# Altium schematic sheet Galileo_sEMG.SchDoc
size A4
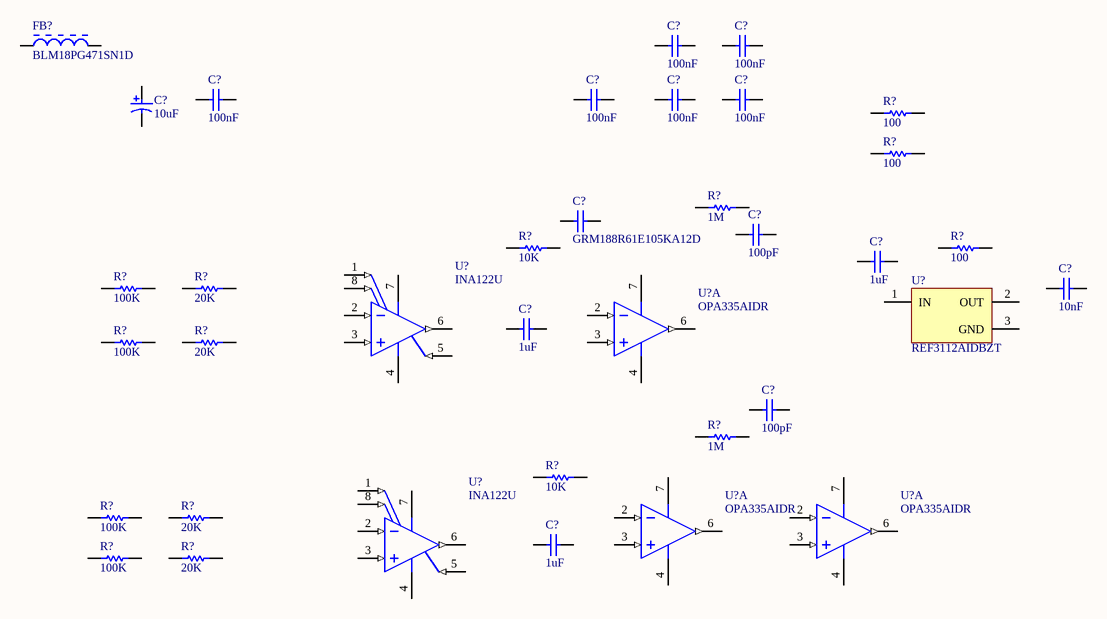
[diagram p0: Galileo_sEMG.SchDoc]

## Parts
(Parts that share a designator on the sheet are numbered #1, #2 ... from top to bottom, then left to right.)
C?#1  100nF  [CAPC0603(1608)100_M]
C?#2  100nF  [CAPC0603(1608)100_M]
C?#3  10uF  [KEMT-A-3216-18-2_M]
C?#4  100nF  [CAPC0603(1608)100_M]
C?#5  100nF  [CAPC0603(1608)100_M]
C?#6  100nF  [CAPC0603(1608)100_M]
C?#7  100nF  [CAPC0603(1608)100_M]
C?#8  GRM188R61E105KA12D  [CAPC1608X90X35LL10T15]
C?#9  100pF  [CAPC1608X90X35LL15T15]
C?#10  1uF  [CAPC1608X90X35LL10T15]
C?#11  10nF  [CAPC2013X70X45ML10T25]
C?#12  1uF  [CAPC1608X90X35LL10T15]
C?#13  100pF  [CAPC1608X90X35LL15T15]
C?#14  1uF  [CAPC1608X90X35LL10T15]
FB?  BLM18PG471SN1D  [MURA-BLM18PG_KG-CHIP-2_V1]
R?#1  100  [RESC1608X55X30NL15T15]
R?#2  100  [RESC1608X55X30NL15T15]
R?#3  1M  [RESC0603(1608)_N]
R?#4  10K  [RESC0603(1608)_N]
R?#5  100  [RESC1608X55X30NL15T15]
R?#6  100K  [RESC0603(1608)_N]
R?#7  20K  [RESC0603(1608)_L]
R?#8  100K  [RESC0603(1608)_N]
R?#9  20K  [RESC0603(1608)_L]
R?#10  1M  [RESC0603(1608)_N]
R?#11  10K  [RESC0603(1608)_N]
R?#12  100K  [RESC0603(1608)_N]
R?#13  20K  [RESC0603(1608)_L]
R?#14  100K  [RESC0603(1608)_N]
R?#15  20K  [RESC0603(1608)_L]
U?#1  REF3112AIDBZT  [DBZ0003A_L]
U?#2  INA122U  [D0008A_M]
U?#3  OPA335AIDR  [D0008A_L]  (part A of 2)
U?#4  OPA335AIDR  [D0008A_L]  (part A of 2)
U?#5  OPA335AIDR  [D0008A_L]  (part A of 2)
U?#6  INA122U  [D0008A_M]

## Nets

Not connected (* = marked no-connect by the designer): C?#1 1 2; C?#2 1 2; C?#3 1 2; C?#4 1 2; C?#5 1 2; C?#6 1 2; C?#7 1 2; C?#8 1 2; C?#9 1 2; C?#10 1 2; C?#11 1 2; C?#12 1 2; C?#13 1 2; C?#14 1 2; FB? 1 2; R?#1 1 2; R?#2 1 2; R?#3 1 2; R?#4 1 2; R?#5 1 2; R?#6 1 2; R?#7 1 2; R?#8 1 2; R?#9 1 2; R?#10 1 2; R?#11 1 2; R?#12 1 2; R?#13 1 2; R?#14 1 2; R?#15 1 2; U?#1 1(IN) 2(OUT) 3(GND); U?#2 1(RG) 2(VIN-) 3(VIN+) 4(V-) 5(REF) 6(VO) 7(V+) 8(RG); U?#3 2(IN-) 3(IN+) 4(V-) 6(OUT) 7(V+); U?#4 2(IN-) 3(IN+) 4(V-) 6(OUT) 7(V+); U?#5 2(IN-) 3(IN+) 4(V-) 6(OUT) 7(V+); U?#6 1(RG) 2(VIN-) 3(VIN+) 4(V-) 5(REF) 6(VO) 7(V+) 8(RG)

## Library data of the parts
C?#1 C?#2 C?#4-C?#7 = CMP-1035-02588-1: CAP 100nF; Case-Metric: 1608; Rated Voltage: 25 V; Case-EIA: 0603; Tolerance: Â±10%; Max Thickness: 1 mm; Technology: SMT; Value: 100nF; Supplier 1: Digi-Key; Supplier Part Number 1: 490-1524-1-ND
C?#3 = CMP-2000-05172-1: Capacitor, Tantalum, 10 uF, +/- 10%, 10 V, -55 to 125 degC, 2-Pin SMD (1206), RoHS, Tape and Reel; Manufacturer Size Code: A; Manufacturer: Kemet; Type: Molded; Online Catalog: T491Series; Other Names: 399-3684-2; Voltage - Rated: 10V; Lifetime @ Temp.: 2000Hrs@85degC; Product Training Modules: CapacitorBasics-TypicalUsesforCapacitorsDeratingGuidelinesforSurfaceMountTantalumCapacitors; ESR (Equivalent Series Resistance): 3.8Ohm; Capacitance: 10µF; Catalog Drawings: T49x,T5xxSeries_A-side1T49x,T5xxSeries_A,B-side2T49x,T5xxSeries_A,SBottom; Family: TantalumCapacitors; Manufacturer URL: http://www.kemet.com/; Datasheet URL: http://www.farnell.com/datasheets/1824869.pdf; Package Reference: 1206; Packaging: Tape&Reel(TR); Series: T491; Operating Temperature: -55degC~125degC; Mounting Type: SurfaceMount; Height - Seated (Max): 0.071"(1.80mm); Package / Case: 1206(3216Metric); Package Description: 2-Pin Surface Mount Device, Body 3.2 x 1.6 mm; Features: GeneralPurpose; Tolerance: ±10%; Lead Spacing: -; Size / Dimension: 0.126"Lx0.063"W(3.20mmx1.60mm); Standard Package: 2,000; Datasheet Version: Apr-14; Category: Capacitors
C?#8 = CMP-2006-02459-1: Manufacturer: Murata; Part Number: GRM188R61E105KA12D
C?#9 C?#13 = CMP-2006-02092-1: Manufacturer: AVX Interconnect / Elco; Part Number: 06033C101KAT2A
C?#10 C?#12 C?#14 = CMP-2006-02459-1: Manufacturer: Murata; Part Number: GRM188R61E105KA12D
C?#11 = CMP-2000-05013-1: Chip Capacitor, 10 nF, +/- 10%, 50 V, -55 to 125 degC, 0805 (2012 Metric), RoHS, Tape and Reel; Manufacturer: Murata; Voltage Rating DC: 50V; Capacitance: 0.01uF; Temperature Coefficient / Code: +/-15%; Capacitance - pF: 10000pF; Case Height: 0.6mm; Dielectric: X7R; Case Length: 2mm; Case Width: 1.25mm; Type: GeneralPurposeMLCC; Brand: MurataElectronics; Tolerance: 10%; Product Category: MultilayerCeramicCapacitorsMLCC-SMD/SMT; Minimum Operating Temperature: -55C; Voltage Rating: 50V; Series: GRM; Packaging: Reel; Dimensions: 1.25mmWx2mmLx0.6mmH; Operating Temperature Range: -55Cto+125C; Package / Case: 0805(2012metric); Datasheet URL: https://datasheet.ciiva.com/29201/452521-da-01-en-vs-kondensator-0805-29201121.pdf; Maximum Operating Temperature: +125C; Factory Pack Quantity: 4000; Case Code - in: 0805; Case Code - mm: 2012; Manufacturer URL: http://www.murata.com/; Termination Style: SMD/SMT; Datasheet Version: Dec-10; RoHS: Details; Product: GeneralTypeMLCCs; Capacitance - nF: 10nF
FB? = CMP-0686-00587-2: Chip Ferrite Bead for Power Lines, 470 Ohm, 1000 mA, -55 to 125 degC, 1.6 x 0.8 x 0.95 mm SMD, Tape and Reel; Manufacturer: Murata; DC Resistance: 0.20 Ohm Max.; Rated Current: 1000 mA; Impedance (at 100 MHz): 470 Ohm +/- 25%; Mounting Technology: Surface Mount; ComponentLink3URL: http://www.murata.com/products/catalog/pdf/c31e.pdf; ComponentLink1URL: http://www.murata.com/; ComponentLink2URL: http://www.murata.com/products/catalog/pdf/c31e.pdf; ComponentLink3Description: Package Specification; PartNumber: BLM18PG471SN1D; ComponentLink1Description: Manufacturer URL; Packing: Tape and Reel; Operating Temperature Range: -55 to 125 degC; PackageReference: BLM18_H950-2; ComponentLink2Description: Datasheet; PackageDescription: 2-Pin Chip, Body 1.6 x 0.8 mm; DatasheetVersion: 08/2013
R?#1 R?#2 R?#5 = CMP-2000-00841-1: Part Number: ERJ-3RQF1R0V; Manufacturer: Panasonic
R?#3 R?#10 = CMP-1012-00146-1: 1M 0.1W 5% 0603 (1608 Metric)  SMD; Case-EIA: 0603; Value: 1000000.00 Ohm; Case-Metric: 1608; Technology: SMT; Power: 0.1 W; Tolerance: 5 %
R?#4 R?#11 = CMP-1012-00098-1: 10K 0.1W 5% 0603 (1608 Metric)  SMD; Case-EIA: 0603; Value: 10000.00 Ohm; Case-Metric: 1608; Technology: SMT; Tolerance: 5 %; Power: 0.1 W
R?#6 R?#8 R?#12 R?#14 = CMP-1012-00122-1: 100K 0.1W 5% 0603 (1608 Metric)  SMD; Case-EIA: 0603; Value: 100000.00 Ohm; Case-Metric: 1608; Tolerance: 5 %; Power: 0.1 W; Technology: SMT
R?#7 R?#9 R?#13 R?#15 = CMP-1012-00655-1: 20K 0.1W 1% 0603 (1608 Metric)  SMD; Case-Metric: 1608; Case-EIA: 0603; Value: 20000.00 Ohm; Technology: SMT; Tolerance: 1 %; Power: 0.1 W
U?#1 = CMP-0367-00165-2: 20 ppm / degC Max, 100 uA Series Voltage Reference, 3-pin SOT-23 (DBZ), Green (RoHS & no Sb/Br); Manufacturer: Texas Instruments; Temp Coeff(Max)(ppm/ degree C): 20; VO(V): 1.25; VI(Min)(V): 1.8; VI(Max)(V): 5.5; Rating: Catalog; Initial Accuracy @ 25/deg C(%): 0.2; Iq(Max)(uA): 100; Temp Coeff(Typ)(ppm/ degree C): 10; PackageDescription: 3-Pin Plastic Small Outline, Body 2.92 x 1.3 mm, Pitch 0.95 mm; SubFamily: Series Voltage Reference; Code_JEDEC: TO-236; PackageReference: DBZ0003A; PackageVersion: 4203227/B; ComponentLink2Description: Datasheet; Mounting Technology: Surface Mount; ComponentLink3URL: http://www.ti.com/litv/pdf/mpds108a; ComponentLink1Description: Manufacturer URL; DatasheetVersion: SBVS046C; PartNumber: REF3112AIDBZT; ComponentLink3Description: Package Specification; ComponentLink2URL: http://www.ti.com/general/docs/lit/getliterature.tsp?genericPartNumber=REF3112&fileType=pdf; ComponentLink1URL: http://www.ti.com/; Eco-Plan: Green (RoHS & no Sb/Br)
U?#2 U?#6 = CMP-0944-00040-2: Single Supply, MicroPower Instrumentation Amplifier, -40 to 85 degC, 8-pin SOIC (D8), Green (RoHS & no Sb/Br); Manufacturer: Texas Instruments; Vs(Min)(V): 2.2; Input Bias Current (+/-)(Max)(nA): 25; Number of Channels: 1; CMRR(Min)(dB): 83; Input Offset (+/-)(Max)(uV): 250; Input Offset Drift (+/-)(Max)(uV/Degrees Celsius): 3; Noise at 1kHz(Typ)(nV/rt(Hz)): 60; Vs(Max)(V): 36; Non-Linearity (+/-)(Max)(%): 0.012; Gain(V/V): 5 to 10000; Quiescent Current (+/-)(Typ)(mA): 0.06; PackageDescription: 8-Pin Plastic Small Outline, Body 4.9 x 3.9 mm, Pitch 1.27 mm; Code_JEDEC: MS-012; PackageReference: D0008A; ComponentLink1Description: Manufacturer URL; PartNumber: INA122U; ComponentLink2URL: http://www.ti.com/general/docs/lit/getliterature.tsp?genericPartNumber=INA122&fileType=pdf; DatasheetVersion: SBOS069; Eco-Plan: Green (RoHS & no Sb/Br); PackageVersion: 4040047-3/M, 06/2011; SubFamily: Single Supply; ComponentLink1URL: http://www.ti.com/; ComponentLink2Description: Datasheet; ComponentLink3Description: Package Specification; ComponentLink3URL: http://www.ti.com/litv/pdf/msoi002j; Mounting Technology: Surface Mount
U?#3-U?#5 = CMP-0272-00647-3: 0.05 uV/C Max, Single-Supply CMOS Operational Amplifier, 2.7 to 5.5 V, -40 to 125 degC, 8-pin SOIC (D8), Green (RoHS & no Sb/Br); Manufacturer: Texas Instruments; Total Supply Voltage(Min)(+5V is 5, +/-5V is 10): 2.7; Slew Rate(Typ)(V/us): 1.6; Number of Channels: 1; Offset Drift(Typ)(uV/C): 0.02; Total Supply Voltage(Max)(+5V is 5, +/-5V is 10): 5.5; Sub Family: Low Offset Voltage Amplifier (<=500uV), Low Power Amp (<=500uA), Low Supply Voltage Amplifier (<=2.7V), Precision Amplifier, Zero Drift Precision Amplifier; CMRR(Min)(dB): 110; IIB(Max)(pA): 200; Vio (25C)(Max)(mV): 0.005; Iq per channel(Max)(mA): 0.35; PackageVersion: 4040047-3/M, 06/2011; ComponentLink2URL: http://www.ti.com/general/docs/lit/getliterature.tsp?genericPartNumber=OPA335&fileType=pdf; ComponentLink3URL: http://www.ti.com/litv/pdf/msoi002j; Code_JEDEC: MS-012; ComponentLink1URL: http://www.ti.com/; ComponentLink3Description: Package Specification; DatasheetVersion: SBOS245D; PartNumber: OPA335AIDR; PackageReference: D0008A; Mounting Technology: Surface Mount; ComponentLink1Description: Manufacturer URL; ComponentLink2Description: Datasheet; PackageDescription: 8-Pin Plastic Small Outline, Body 4.9 x 3.9 mm, Pitch 1.27 mm; Eco-Plan: Green (RoHS & no Sb/Br)